# Altium schematic sheet Sheet1_GMAX0505_2518_MB.SchDoc
size A4; SheetNumber: 1; SheetTotal: 1
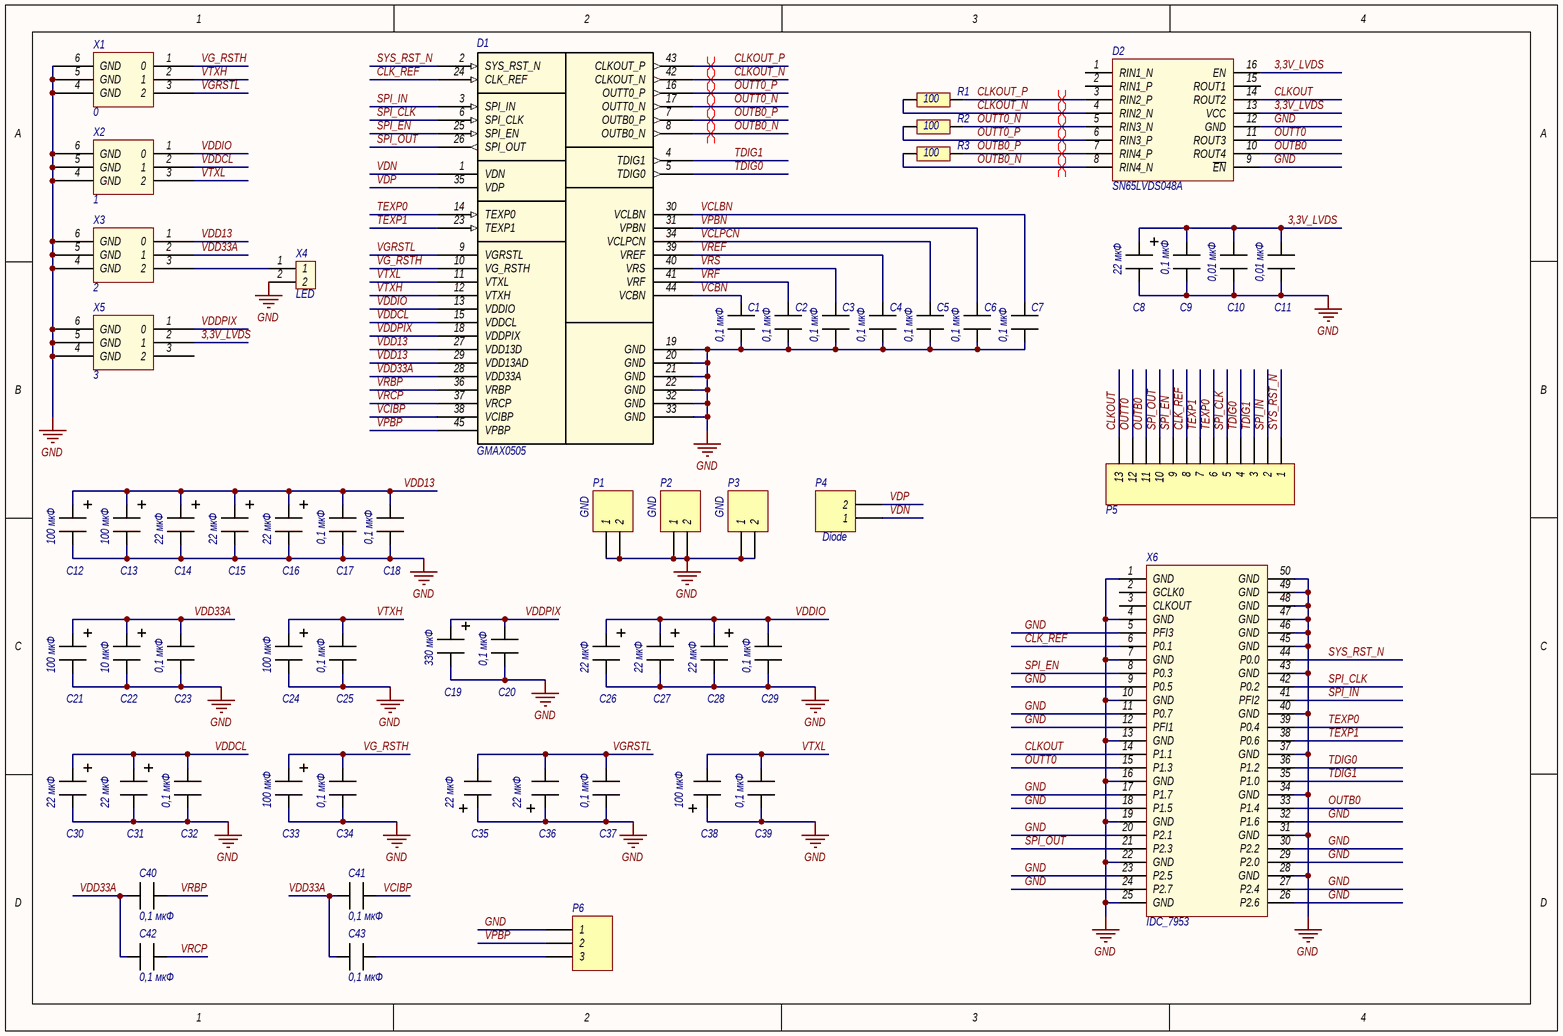
[diagram p0: Sheet1_GMAX0505_2518_MB.SchDoc]

## Parts
C1  0,1 мкФ  [CAP_SMALL]
C2  0,1 мкФ  [CAP_SMALL]
C3  0,1 мкФ  [CAP_SMALL]
C4  0,1 мкФ  [CAP_SMALL]
C5  0,1 мкФ  [CAP_SMALL]
C6  0,1 мкФ  [CAP_SMALL]
C7  0,1 мкФ  [CAP_SMALL]
C8  22 мкФ  [Cap_0511_electrolitic]
C9  0,1 мкФ  [CAP_SMALL]
C10  0,01 мкФ  [CAP_SMALL]
C11  0,01 мкФ  [CAP_SMALL]
C12  100 мкФ  [Cap_0612_electrolitic]
C13  100 мкФ  [Cap_0612_electrolitic]
C14  22 мкФ  [Cap_0511_electrolitic]
C15  22 мкФ  [Cap_0511_electrolitic]
C16  22 мкФ  [Cap_0511_electrolitic]
C17  0,1 мкФ  [CAP_SMALL]
C18  0,1 мкФ  [CAP_SMALL]
C19  330 мкФ  [Cap_1013_electrolitic]
C20  0,1 мкФ  [CAP_SMALL]
C21  100 мкФ  [Cap_0612_electrolitic]
C22  10 мкФ  [Cap_0511_electrolitic]
C23  0,1 мкФ  [CAP_SMALL]
C24  100 мкФ  [Cap_0612_electrolitic]
C25  0,1 мкФ  [CAP_SMALL]
C26  22 мкФ  [Cap_0511_electrolitic]
C27  22 мкФ  [Cap_0511_electrolitic]
C28  22 мкФ  [Cap_0511_electrolitic]
C29  0,1 мкФ  [CAP_SMALL]
C30  22 мкФ  [Cap_0511_electrolitic]
C31  22 мкФ  [Cap_0511_electrolitic]
C32  0,1 мкФ  [CAP_SMALL]
C33  100 мкФ  [Cap_0612_electrolitic]
C34  0,1 мкФ  [CAP_SMALL]
C35  22 мкФ  [Cap_0511_electrolitic]
C36  22 мкФ  [Cap_0511_electrolitic]
C37  0,1 мкФ  [CAP_SMALL]
C38  100 мкФ  [Cap_0612_electrolitic]
C39  0,1 мкФ  [CAP_SMALL]
C40  0,1 мкФ  [CAP_SMALL]
C41  0,1 мкФ  [CAP_SMALL]
C42  0,1 мкФ  [CAP_SMALL]
C43  0,1 мкФ  [CAP_SMALL]
D1  GMAX0505  [GMAX0505_MEZ]
D2  SN65LVDS048A  [SN65LVDS048A (4LVDS)]
P1  GND  [HDR1X2]
P2  GND  [HDR1X2]
P3  GND  [HDR1X2]
P4  Diode  [HDR1X2]
P5  Header 13  [HDR1X13]  (value not drawn)
P6  VPBP  [HDR1X3]  (value not drawn)
R1  100  [RES]
R2  100  [RES]
R3  100  [RES]
X1  0  [POWER]
X2  1  [POWER]
X3  2  [POWER]
X4  LED  [KLEMMNIK_2]
X5  3  [POWER]
X6  IDC_7953  [IDC_7953]

## Nets
GND: C1.2 C2.2 C3.2 C4.2 C5.2 C6.2 C7.2 C8.2 C9.1 C10.1 C11.1 C12.2 C13.2 C14.2 C15.2 C16.2 C17.2 C18.2 C19.2 C20.2 C21.2 C22.2 C23.2 C24.2 C25.2 C26.2 C27.2 C28.2 C29.2 C30.2 C31.2 C32.1 C33.2 C34.2 C35.1 C36.1 C37.1 C38.1 C39.2 D1.19(GND) D1.20(GND) D1.21(GND) D1.22(GND) D1.32(GND) D1.33(GND) D2.9(~{EN}) D2.12(GND) P1.1 P1.2 P2.1 P2.2 P3.1 P3.2 P6.1 X1.4(GND) X1.5(GND) X1.6(GND) X2.4(GND) X2.5(GND) X2.6(GND) X3.4(GND) X3.5(GND) X3.6(GND) X4.2 X5.4(GND) X5.5(GND) X5.6(GND) X6.1(GND) X6.4(GND) X6.5(PFI3) X6.7(GND) X6.9(P0.5) X6.10(GND) X6.11(P0.7) X6.12(PFI1) X6.13(GND) X6.16(GND) X6.17(P1.7) X6.18(P1.5) X6.19(GND) X6.20(P2.1) X6.22(GND) X6.23(P2.5) X6.24(P2.7) X6.25(GND) X6.26(P2.6) X6.27(P2.4) X6.28(GND) X6.29(P2.0) X6.30(P2.2) X6.31(GND) X6.32(P1.6) X6.34(GND) X6.37(GND) X6.40(GND) X6.43(GND) X6.45(GND) X6.46(GND) X6.47(GND) X6.48(GND) X6.49(GND) X6.50(GND)
3,3V_LVDS: C8.1 C9.2 C10.2 C11.2 D2.13(VCC) D2.16(EN) X5.2(1)
CLK_REF: D1.24(CLK_REF) P5.8 X6.6(P0.1)
CLKOUT: D2.14(ROUT2) P5.13 X6.14(P1.1)
CLKOUT_N: D1.42(CLKOUT_N) D2.4(RIN2_N) R1.2
CLKOUT_P: D1.43(CLKOUT_P) D2.3(RIN2_P) R1.1
OUTB0: D2.10(ROUT4) P5.11 X6.33(P1.4)
OUTB0_N: D1.8(OUTB0_N) D2.8(RIN4_N) R3.2
OUTB0_P: D1.7(OUTB0_P) D2.7(RIN4_P) R3.1
OUTT0: D2.11(ROUT3) P5.12 X6.15(P1.3)
OUTT0_N: D1.17(OUTT0_N) D2.5(RIN3_N) R2.1
OUTT0_P: D1.16(OUTT0_P) D2.6(RIN3_P) R2.2
SPI_CLK: D1.6(SPI_CLK) P5.5 X6.42(P0.2)
SPI_EN: D1.25(SPI_EN) P5.9 X6.8(P0.3)
SPI_IN: D1.3(SPI_IN) P5.2 X6.41(PFI2)
SPI_OUT: D1.26(SPI_OUT) P5.10 X6.21(P2.3)
SYS_RST_N: D1.2(SYS_RST_N) P5.1 X6.44(P0.0)
TDIG0: D1.5(TDIG0) P5.4 X6.36(P1.2)
TDIG1: D1.4(TDIG1) P5.3 X6.35(P1.0)
TEXP0: D1.14(TEXP0) P5.6 X6.39(P0.4)
TEXP1: D1.23(TEXP1) P5.7 X6.38(P0.6)
VCBN: C1.1 D1.44(VCBN)
VCIBP: C41.1 D1.38(VCIBP)
VCLBN: C7.1 D1.30(VCLBN)
VCLPCN: C5.1 D1.34(VCLPCN)
VDD13: C12.1 C13.1 C14.1 C15.1 C16.1 C17.1 C18.1 D1.27(VDD13D) D1.29(VDD13AD) X3.1(0)
VDD33A: C21.1 C22.1 C23.1 C40.2 C41.2 C42.2 C43.2 D1.28(VDD33A) X3.2(1)
VDDCL: C30.1 C31.1 C32.2 D1.15(VDDCL) X2.2(1)
VDDIO: C26.1 C27.1 C28.1 C29.1 D1.13(VDDIO) X2.1(0)
VDDPIX: C19.1 C20.1 D1.18(VDDPIX) X5.1(0)
VDN: D1.1(VDN) P4.1
VDP: D1.35(VDP) P4.2
VG_RSTH: C33.1 C34.1 D1.10(VG_RSTH) X1.1(0)
VGRSTL: C35.2 C36.2 C37.2 D1.9(VGRSTL) X1.3(2)
VPBN: C6.1 D1.31(VPBN)
VPBP: D1.45(VPBP) P6.2
VRBP: C40.1 D1.36(VRBP)
VRCP: C42.1 D1.37(VRCP)
VREF: C4.1 D1.39(VREF)
VRF: C2.1 D1.41(VRF)
VRS: C3.1 D1.40(VRS)
VTXH: C24.1 C25.1 D1.12(VTXH) X1.2(1)
VTXL: C38.2 C39.1 D1.11(VTXL) X2.3(2)
NetC43_1: C43.1 P6.3
NetX3_3: X3.3(2) X4.1

Not connected (* = marked no-connect by the designer): D2 1(RIN1_N) 2(RIN1_P) 15(ROUT1); X5 3(2); X6 2(GCLK0) 3(CLKOUT)

## Layout directives
differential pair: CLKOUT_N, CLKOUT_P, OUTB0_N, OUTB0_P, OUTT0_N, OUTT0_P

## Library data of the parts
C1-C7 C9-C11 C17 C18 C20 C23 C25 C29 C32 C34 C37 C39-C43 = CAP_SMALL
C8 C14-C16 C22 C26-C28 C30 C31 C35 C36 = Cap_electrolotoc_0511
C12 C13 C21 C24 C33 C38 = Cap_electrolotoc_0612
C19 = Cap_electrolotoc_1013
D1 = GMAX0505_MEZ
D2 = SN65LVDS048A (4LVDS)
P1-P4 = Header 2: Header, 2-Pin; LatestRevisionDate: 17-Jul-2002; LatestRevisionNote: Re-released for DXP Platform.; Publisher: Altium Limited
P5 = Header 13: Header, 13-Pin; LatestRevisionDate: 17-Jul-2002; LatestRevisionNote: Re-released for DXP Platform.; Publisher: Altium Limited
P6 = Header 3: Header, 3-Pin; LatestRevisionDate: 17-Jul-2002; LatestRevisionNote: Re-released for DXP Platform.; Publisher: Altium Limited
R1-R3 = RES
X1-X3 X5 = POWER
X4 = KLEMMNIK_2